# EAGLE design dmf (EAGLE 7.1.0)

## Sheet 1 of 2
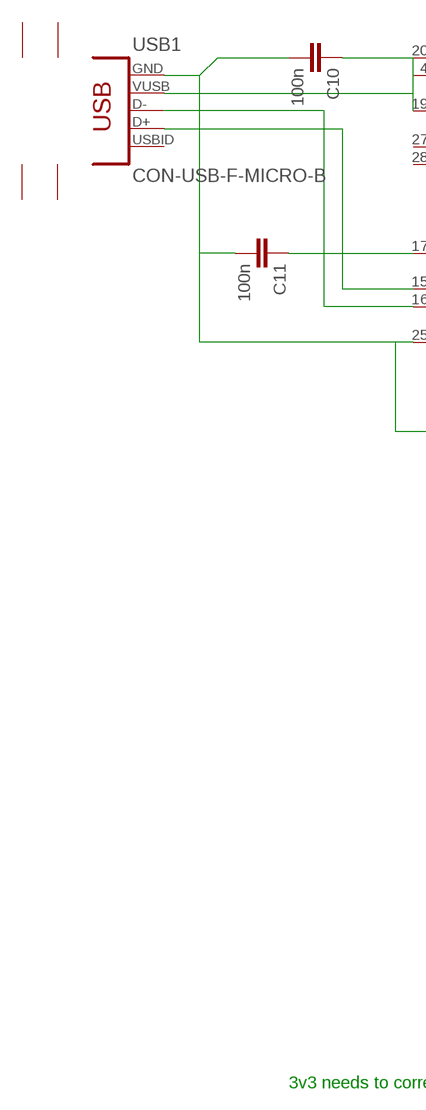
[diagram p0: schematic, sheet 1, part 1 of 2]
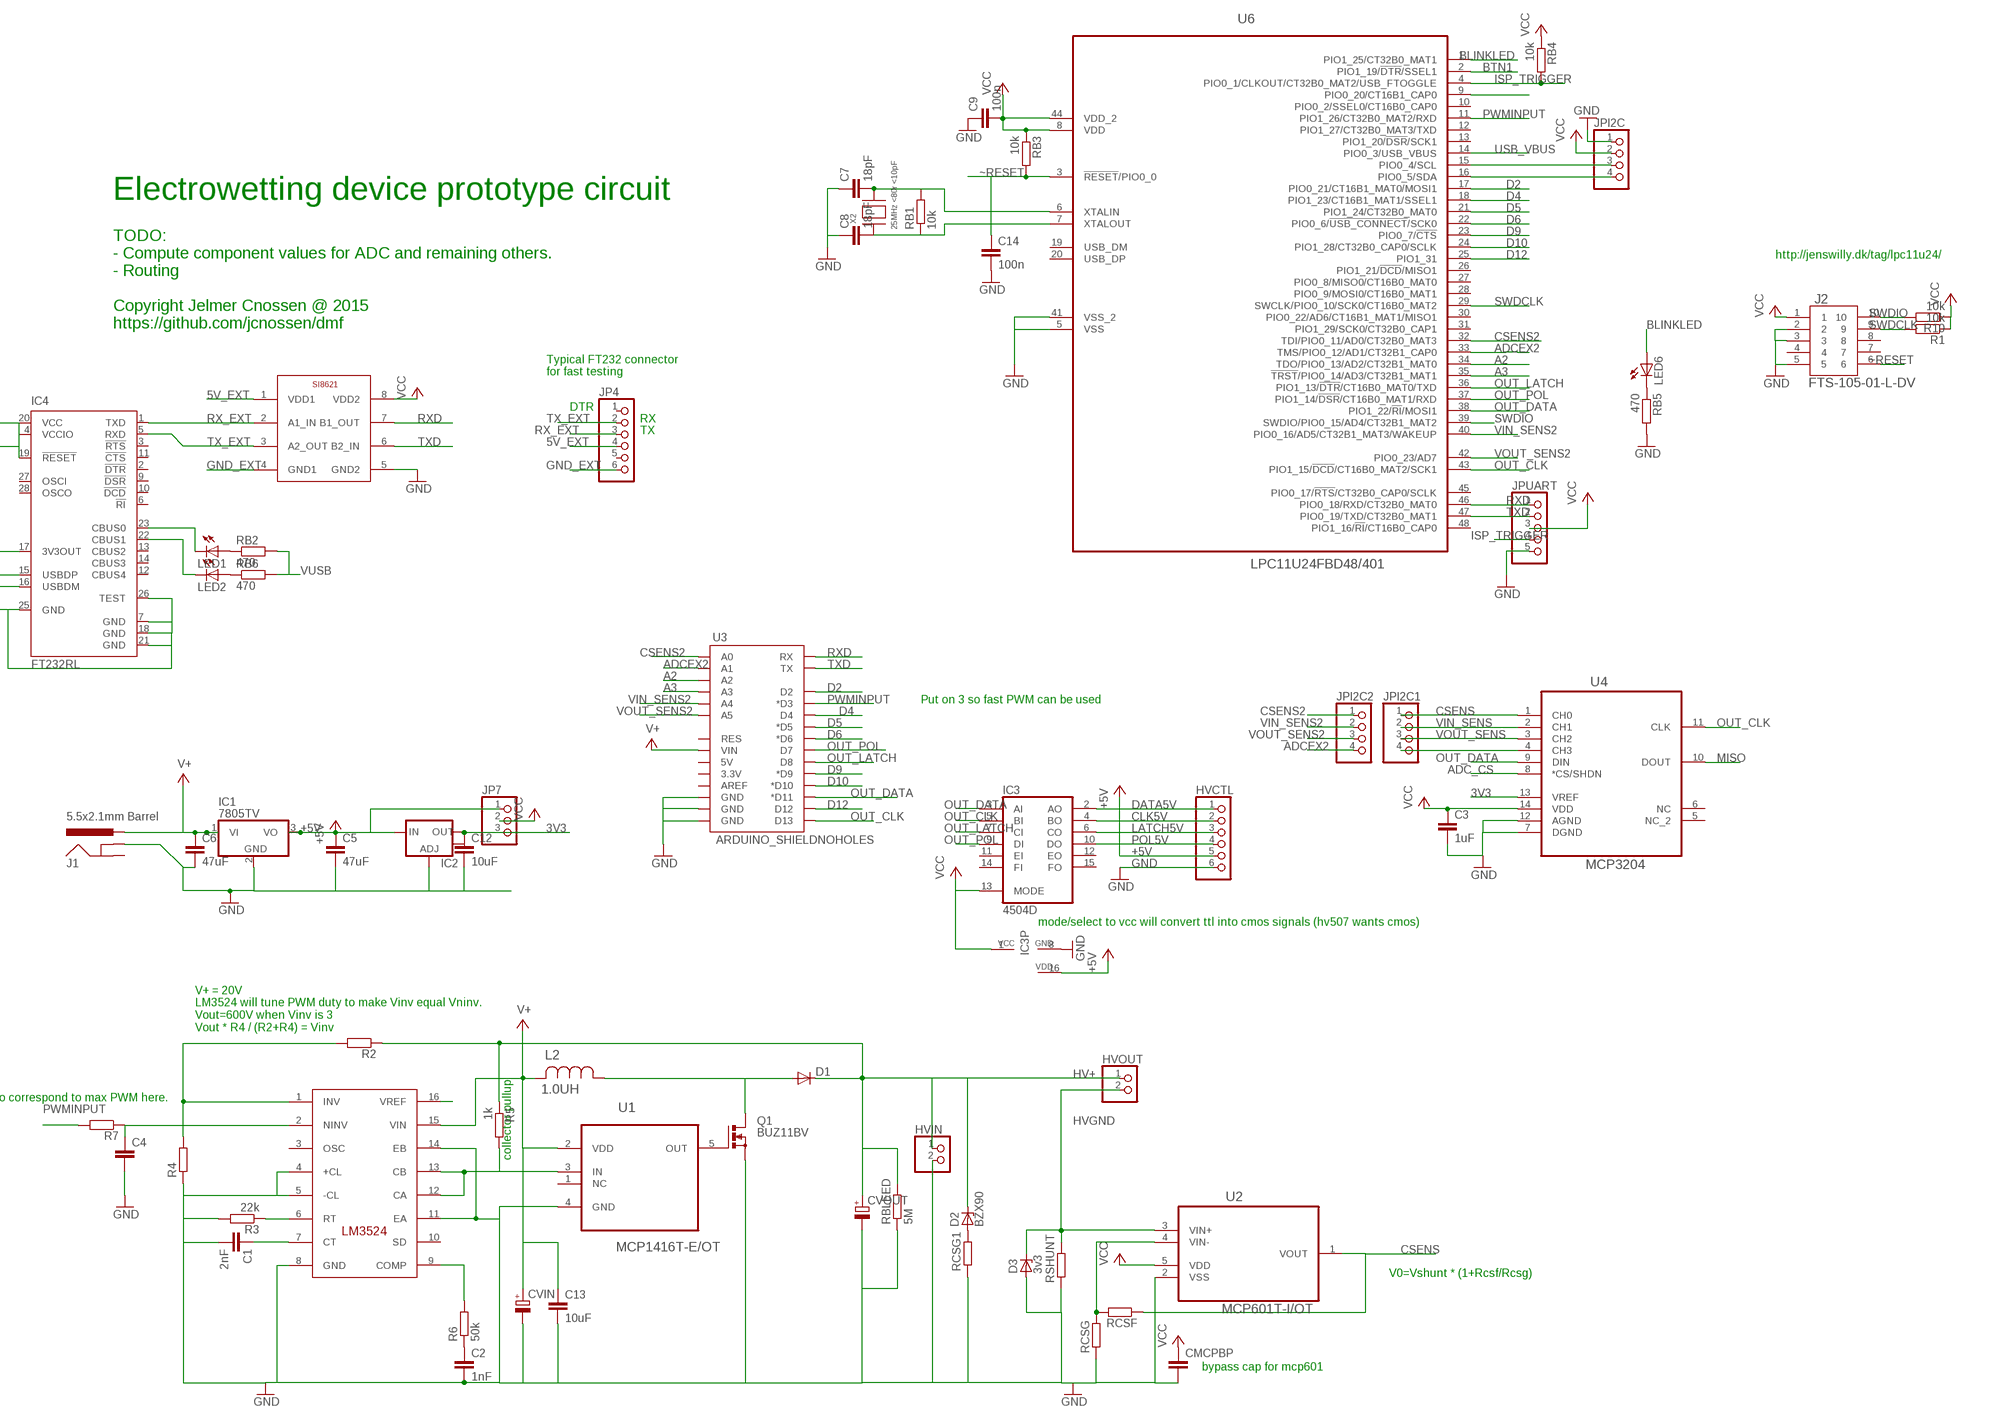
[diagram p1: schematic, sheet 1, part 2 of 2]

### Parts
C1  2nF  C-EUC0805  [C0805]
C2  1nF  C-EUC0805  [C0805]
C3  1uF  C-EUC0805  [C0805]
C4  C-EUC0805  [C0805]
C5  47uF  C-EUC1206  [C1206]
C6  47uF  C-EUC1206  [C1206]
C7  18pF  C-EUC0805  [C0805]
C8  18pF  C-EUC0805  [C0805]
C9  100n  C-EUC0805  [C0805]
C10  100n  C-EUC0805  [C0805]
C11  100n  C-EUC0805  [C0805]
C12  10uF  C-EUC1206  [C1206]
C13  10uF  C-EUC0805  [C0805]
C14  100n  C-EUC0805  [C0805]
CMCPBP  C-EUC0805  [C0805]
CVIN  CPOL-EUE7.5-18  [E7,5-18]
CVOUT  CPOL-EUE7.5-18  [E7,5-18]
D1  DIODE-SMB  [SMB]
D2  BZX90  [DO34Z7]
D3  3v3  ZENER-DIODESMB  [SMB]
HVCTL  PINHD-1X06_2.54-S  [1X06-S]
HVIN  PINHD-1X02_2.54  [1X02]
HVOUT  PINHD-1X02_2.54  [1X02]
IC1  7805TV  [TO220V]
IC2  V_REG_LM1117SOT223  [SOT223]
IC3  4504D  [SO16]
IC4  FT232RL  [SSOP28]
J1  5.5x2.1mm Barrel  POWER_JACKSMD  [POWER_JACK_SMD]
J2  FTS-105-01-L-DV  [SAMTEC_FTS-105-01-L-DV]
JP4  PINHD-1X06_2.54-S  [1X06-S]
JP7  PINHD-1X03_2.54-S  [1X03-S]
JPI2C  PINHD-1X04_2.54-S  [1X04-S]
JPI2C1  PINHD-1X04_2.54-S  [1X04-S]
JPI2C2  PINHD-1X04_2.54-S  [1X04-S]
JPUART  PINHD-1X05_2.54-S  [1X05-S]
L2  1.0UH  ELL6RH1R0M-6XH  [IND_ELL6XH]
LED1  LEDCHIP-LED0805  [CHIP-LED0805]
LED2  LEDCHIP-LED0805  [CHIP-LED0805]
LED6  LEDCHIP-LED0805  [CHIP-LED0805]
Q1  BUZ11BV  [TO220BV]
R1  10k  R-EU_R0603  [R0603]
R2  R-EU_R0603  [R0603]
R3  22k  R-EU_R0603  [R0603]
R4  R-EU_R0603  [R0603]
R5  1k  R-EU_R0603  [R0603]
R6  50k  R-EU_R0603  [R0603]
R7  R-EU_R0603  [R0603]
R10  10k  R-EU_R0603  [R0603]
RB1  10k  R-EU_R0603  [R0603]
RB2  470  R-EU_R0603  [R0603]
RB3  10k  R-EU_R0603  [R0603]
RB4  10k  R-EU_R0603  [R0603]
RB5  470  R-EU_R0402  [R0402]
RB6  470  R-EU_R0603  [R0603]
RBLEED  5M  R-EU_R1206  [R1206]
RCSF  R-EU_R0603  [R0603]
RCSG  R-EU_R0603  [R0603]
RCSG1  R-EU_R1206  [R1206]
RSHUNT  R-EU_R1206  [R1206]
U1  MCP1416T-E/OT  [SOT95P270X145-5N]
U2  MCP601T-I/OT  [SOT95P320X145-5N]
U3  ARDUINO_SHIELDNOHOLES  [DUEMILANOVE_SHIELD_NOHOLES]
U4  MCP3204  MCP3204-CI/SL  [SOIC127P600X175-14N]
U6  LPC11U24FBD48/401  [QFP50P900X900X160-48N]
U$1  LM3524  [SO16]
U$2  SI8621AB  [SO8]
USB1  CON-USB-F-MICRO-B  [CONN_USB_MICRO-B]
X2  25MHz <80r <10pF  XTALNX5032  [NX5032]

### Nets
3V3: C12.1 IC2.2(OUT) JP7.3 U4.13(VREF)
5V_EXT: JP4.4 U$2.1(VDD1)
+5V: C5.1 HVCTL.5 IC1.3(VO) IC2.3(IN) IC3.16(VDD) JP7.1
A2: U3.A2 U6.34(TDO/PIO0_13/AD2/CT32B1_MAT0)
A3: U3.A3 U6.35(!TRST!/PIO0_14/AD3/CT32B1_MAT1)
ADC_CS: U4.8(*CS/SHDN)
ADCEX: JPI2C1.4 U4.4(CH3)
ADCEX2: JPI2C2.4 U3.A1 U6.33(TMS/PIO0_12/AD1/CT32B1_CAP0)
BLINKLED: LED6.A U6.1(PIO1_25/CT32B0_MAT1)
BTN1: U6.2(PIO1_19/!DTR!/SSEL1)
CLK5V: HVCTL.2 IC3.4(BO)
COLLECTOR: R5.2 U1.3(IN) U$1.12(CA) U$1.13(CB)
CSENS: JPI2C1.1 RCSF.1 U2.1(VOUT) U4.1(CH0)
CSENS2: JPI2C2.1 U3.A0 U6.32(TDI/PIO0_11/AD0/CT32B0_MAT3)
D2: U3.D2 U6.17(PIO0_21/CT16B1_MAT0/MOSI1)
D4: U3.D4 U6.18(PIO1_23/CT16B1_MAT1/SSEL1)
D5: U3.D5(*D5) U6.21(PIO1_24/CT32B0_MAT0)
D6: U3.D6(*D6) U6.22(PIO0_6/!USB_CONNECT!/SCK0)
D9: U3.D9(*D9) U6.23(PIO0_7/!CTS)
D10: U3.D10(*D10) U6.24(PIO1_28/CT32B0_CAP0/SCLK)
D12: U3.D12 U6.25(PIO1_31)
DATA5V: HVCTL.1 IC3.2(AO)
GND: C1.2 C2.2 C3.2 C4.2 C5.2 C6.2 C7.1 C8.1 C9.1 C12.2 C13.2 C14.2 CMCPBP.2 CVIN.- CVOUT.- D3.A HVCTL.6 HVIN.2 IC1.2(GND) IC2.1(ADJ) IC3.8(GND) J1.GND(GNDBREAK) J2.2 J2.3 J2.5 JPI2C.1 JPUART.5 Q1.S R3.2 R4.1 RB5.2 RBLEED.1 RCSG1.1 RCSG.1 RSHUNT.1 U1.4(GND) U2.2(VSS) U3.GND@0(GND) U3.GND@1(GND) U3.GND@2(GND) U4.7(DGND) U4.12(AGND) U6.5(VSS) U6.41(VSS_2) U$1.4(+CL) U$1.5(-CL) U$1.8(GND) U$1.11(EA) U$1.14(EB) U$2.5(GND2)
GND_EXT: C10.2 C11.2 IC4.7(GND) IC4.18(GND) IC4.21(GND) IC4.25(GND) IC4.26(TEST) JP4.6 U$2.4(GND1) USB1.P5(GND)
HV+: CVOUT.+ D1.C D2.C HVIN.1 HVOUT.1 R2.1 R5.1 RBLEED.2
HVGND: D3.C HVOUT.2 RSHUNT.2 U2.3(VIN+)
ISP_TRIGGER: JPUART.4 RB4.2 U6.4(PIO0_1/CLKOUT/CT32B0_MAT2/USB_FTOGGLE)
LATCH5V: HVCTL.3 IC3.6(CO)
MISO: U4.10(DOUT)
N$2: C2.1 R6.1
N$3: C1.1 U$1.7(CT)
N$4: U$1.16(VREF)
N$5: R2.2 R4.2 U$1.1(INV)
N$6: R3.1 U$1.6(RT)
N$7: R6.2 U$1.9(COMP)
N$9: D1.A L2.1 Q1.D
N$10: Q1.G U1.5(OUT)
N$11: RCSF.2 RCSG.2 U2.4(VIN-)
N$12: D2.A RCSG1.2
N$14: C4.1 R7.1 U$1.2(NINV)
N$18: IC4.16(USBDM) USB1.P2(D-)
N$19: U6.9(PIO0_20/CT16B1_CAP0)
N$20: IC4.15(USBDP) USB1.P3(D+)
N$21: C11.1 IC4.17(3V3OUT)
N$23: IC4.23(CBUS0) LED1.C
N$24: IC4.22(CBUS1) LED2.C
N$25: LED1.A RB2.1
N$26: LED2.A RB6.1
N$33: C8.2 RB1.1 U6.7(XTALOUT) X2.P$1
N$37: LED6.C RB5.1
N$41: C7.2 RB1.2 U6.6(XTALIN) X2.P$2
OUT_CLK: IC3.5(BI) U3.D13 U4.11(CLK) U6.43(PIO1_15/!DCD!/CT16B0_MAT2/SCK1)
OUT_DATA: IC3.3(AI) U3.D11(*D11) U4.9(DIN) U6.38(PIO1_22/!RI!/MOSI1)
OUT_LATCH: IC3.7(CI) U3.D8 U6.36(PIO1_13/!DTR!/CT16B0_MAT0/TXD)
OUT_POL: IC3.9(DI) U3.D7 U6.37(PIO1_14/!DSR!/CT16B0_MAT1/RXD)
POL5V: HVCTL.4 IC3.10(DO)
PWMINPUT: R7.2 U3.D3(*D3) U6.11(PIO1_26/CT32B0_MAT2/RXD)
RX_EXT: IC4.1(TXD) JP4.3 U$2.2(A1_IN)
RXD: JPUART.1 U3.RX U6.46(PIO0_18/RXD/CT32B0_MAT0) U$2.7(B1_OUT)
SCL: JPI2C.3 U6.15(PIO0_4/SCL)
SDA: JPI2C.4 U6.16(PIO0_5/SDA)
SWDCLK: J2.9 R1.2 U6.29(SWCLK/PIO0_10/SCK0/CT16B0_MAT2)
SWDIO: J2.10 R10.2 U6.39(SWDIO/PIO0_15/AD4/CT32B1_MAT2)
TX_EXT: IC4.5(RXD) JP4.2 U$2.3(A2_OUT)
TXD: JPUART.2 U3.TX U6.47(PIO0_19/TXD/CT32B0_MAT1) U$2.6(B2_IN)
USB_VBUS: U6.14(PIO0_3/USB_VBUS)
V+: C6.1 C13.1 CVIN.+ IC1.1(VI) J1.VIN0(PWR) L2.2 U1.2(VDD) U3.VIN U$1.15(VIN)
VCC: C3.1 C9.2 CMCPBP.1 IC3.1(VCC) IC3.13(MODE) J2.1 JP7.2 JPI2C.2 JPUART.3 R1.1 R10.1 RB3.1 RB4.1 U2.5(VDD) U4.14(VDD) U6.8(VDD) U6.44(VDD_2) U$2.8(VDD2)
VIN_SENS: JPI2C1.2 U4.2(CH1)
VIN_SENS2: JPI2C2.2 U3.A4 U6.40(PIO0_16/AD5/CT32B1_MAT3/WAKEUP)
VOUT_SENS: JPI2C1.3 U4.3(CH2)
VOUT_SENS2: JPI2C2.3 U3.A5 U6.42(PIO0_23/AD7)
VUSB: C10.1 IC4.4(VCCIO) IC4.19(!RESET) IC4.20(VCC) RB2.2 RB6.2 USB1.P1(VUSB)
~RESET: C14.1 J2.6 RB3.2 U6.3(!RESET!/PIO0_0)
Unconnected: IC2.4(OUT) IC3.11(EI) IC3.12(EO) IC3.14(FI) IC3.15(FO) IC4.2(!DTR) IC4.3(!RTS) IC4.6(!RI) IC4.9(!DSR) IC4.10(!DCD) IC4.11(!CTS) IC4.12(CBUS4) IC4.13(CBUS2) IC4.14(CBUS3) IC4.27(OSCI) IC4.28(OSCO) J1.P$4(GND) J2.4 J2.7 J2.8 JP4.1 JP4.5 U1.1(NC) U3.3.3V U3.5V U3.AREF U3.RES U4.5(NC_2) U4.6(NC) U6.10(PIO0_2/SSEL0/CT16B0_CAP0) U6.12(PIO1_27/CT32B0_MAT3/TXD) U6.13(PIO1_20/!DSR!/SCK1) U6.19(USB_DM) U6.20(USB_DP) U6.26(PIO1_21/!DCD!/MISO1) U6.27(PIO0_8/MISO0/CT16B0_MAT0) U6.28(PIO0_9/MOSI0/CT16B0_MAT1) U6.30(PIO0_22/AD6/CT16B1_MAT1/MISO1) U6.31(PIO1_29/SCK0/CT32B0_CAP1) U6.45(PIO0_17/!RTS!/CT32B0_CAP0/SCLK) U6.48(PIO1_16/!RI!/CT16B0_CAP0) U$1.3(OSC) U$1.10(SD) USB1.BODY@1(BODY) USB1.BODY@2(BODY) USB1.BODY@3(BODY) USB1.BODY@4(BODY) USB1.P4(USBID)

### Notes on the sheet
- Electrowetting device prototype circuit
- http://jenswilly.dk/tag/lpc11u24/
- TODO: 
  - Compute component values for ADC and remaining others.
  - Routing
  
  Copyright Jelmer Cnossen @ 2015
  https://github.com/jcnossen/dmf
- Typical FT232 connector 
  for fast testing
- DTR
- RX
- TX
- Put on 3 so fast PWM can be used
- mode/select to vcc will convert ttl into cmos signals (hv507 wants cmos)
- V+ = 20V
  LM3524 will tune PWM duty to make Vinv equal Vninv. 
  Vout=600V when Vinv is 3
  Vout * R4 / (R2+R4) = Vinv
- 3v3 needs to correspond to max PWM here.
- collector pullup
- V0=Vshunt * (1+Rcsf/Rcsg)
- bypass cap for mcp601

## Sheet 2 of 2

## Library data of the parts
C1-C14 CMCPBP = rcl:C-EU: CAPACITOR, European symbol
CVIN CVOUT = rcl:CPOL-EU: POLARIZED CAPACITOR, European symbol
D1 = diode:DIODE-: DIODE
D2 = diode:BZX90: Z DIODE
D3 = diode:ZENER-DIODE: Z-Diode
HVCTL JP4 = pinhead-2:PINHD-1X06: PIN HEADER
HVIN HVOUT = pinhead-2:PINHD-1X02: PIN HEADER
IC1 = linear:78*: Positive VOLTAGE REGULATOR Source: http://cache.national.com/ds/LM/LM78L05.pdf http://www.fairchildsemi.com/ds/LM/LM7805.pdf
IC2 = SparkFun-PowerIC:V_REG_LM1117: Voltage Regulator LM1117 Standard adjustable voltage regulator but in SMD form. Spark Fun Electronics SKU : COM-00595
IC3 = 45xx:4504: TTL or CMOS to CMOS hex LEVEL SHIFTER
IC4 = ftdichip:FT232R: Source: http://www.ftdichip.com/Documents/DataSheets/DS_FT232R_v104.pdf; MPN: FT232RL; OC_FARNELL: 1146032; OC_NEWARK: 91K9918
J1 = SparkFun-Connectors:POWER_JACK: Power Jack This is the standard 5.5mm barrel jack for power. The PTH is the most common, proven, reliable, footprint. The Slot footprint only works if the mill layer is transmitted to the PCB fab house so be warned. Spark Fun Electronics SKU : PRT-00119 SMT: CONN-08106 Mating wall wart : TOL-00298 (and others); PROD_ID: CONN-08106
J2 = hvgen:FTS-105-01-L-DV; DESCRIPTION: Through Hole Post Header; MPN: FTS-105-01-L-DV; OC_FARNELL: 1667729; OC_NEWARK: 11P4653; PACKAGE: CONN HEADER 10POS DUAL .05" SMD; SUPPLIER: Samtec
JP7 = pinhead-2:PINHD-1X03: PIN HEADER
JPI2C JPI2C1 JPI2C2 = pinhead-2:PINHD-1X04: PIN HEADER
JPUART = pinhead-2:PINHD-1X05: PIN HEADER
L2 = Panasonic-ELL:ELL: Choke Coils; MPN: ELL6RH1R0M; OC_FARNELL: 1198589; OC_NEWARK: 01M7773; PACKAGE: SMD; SUPPLIER: PANASONIC
LED1 LED2 LED6 = adafruit:LED: LED
Q1 = transistor-power:BUZ11: N-CHANNEL MOS FET
R1 R10 = resistor:R-EU_: RESISTOR, European symbol
R2-R7 RB1-RB6 RBLEED RCSF RCSG RCSG1 RSHUNT = rcl:R-EU_: RESISTOR, European symbol
U1 = hvgen:MCP1416T-E/OT: High-Speed Power MOSFET Driver; MPN: MCP1416T-E/OT; OC_FARNELL: 1630421; OC_NEWARK: 02P6620; PACKAGE: SOT-5; SUPPLIER: Microchip
U2 = hvgen:MCP601T-I/OT: IC OPAMP SNGL SUPPLY R-R; MPN: MCP601T-I/OT; OC_FARNELL: 9758631; OC_NEWARK: 73K1003; PACKAGE: SOT-23-5; SUPPLIER: Microchip
U3 = SparkFun-Boards:ARDUINO_SHIELD: Arduino shield footprint
U4 = hvgen:MCP3204-CI/SL: IC ADC 12BIT 2.7V 4CH SPI; MPN: MCP3204-CI/SL; OC_FARNELL: 1196795; OC_NEWARK: 26M1276; PACKAGE: 14 - SOIC; SUPPLIER: Microchip
U6 = splitter-parts:LPC11U24FBD48/401: IC, 32-bit ARM Cortex-M0 microcontroller, 48LQFP; MPN: LPC11U24FBD48/401; OC_FARNELL: 2069972; OC_NEWARK: 73T6643; PACKAGE: 48LQFP; SUPPLIER: NXP
U$1 = hvgen:LM3524
U$2 = hvgen:SI8621AB
USB1 = dp_devices:CON-USB-F: USB Female connector
X2 = adafruit:XTAL: Low cost SMT crystals, no capacitors included http://www.ladyada.net/library/eagle

## Board
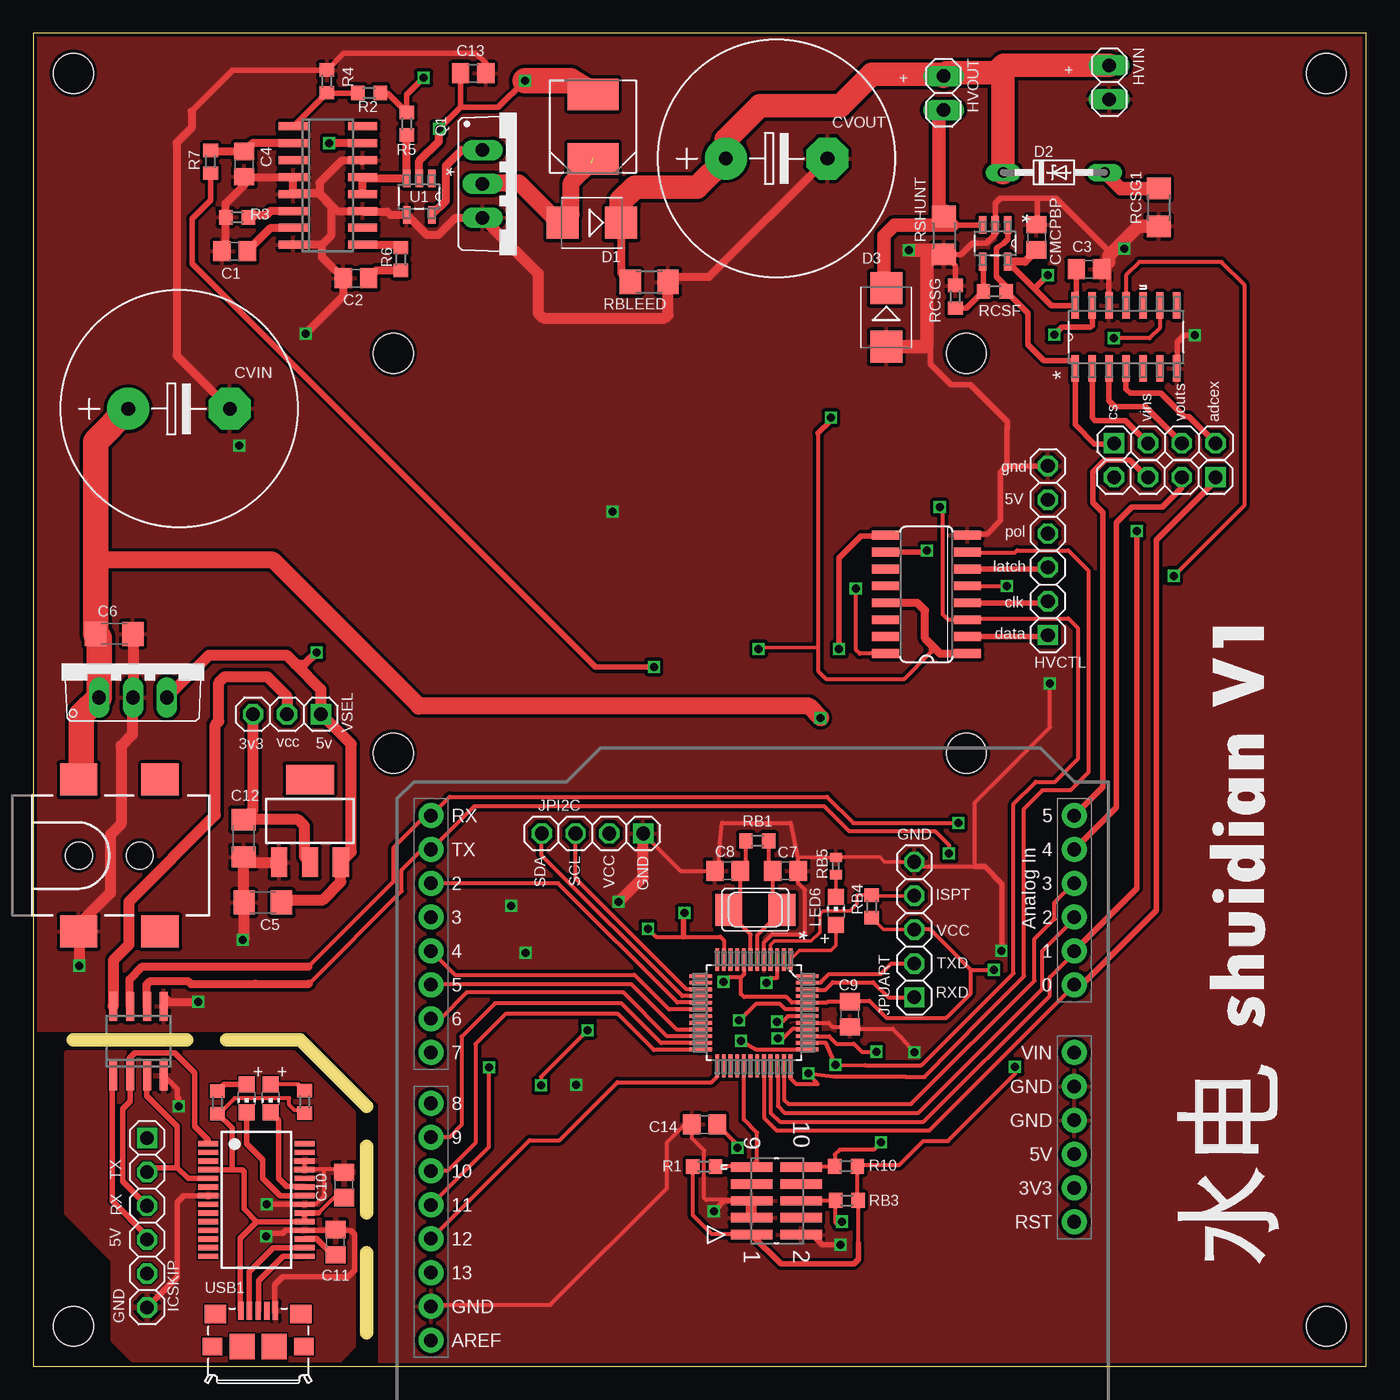
[diagram p2: board, top side]
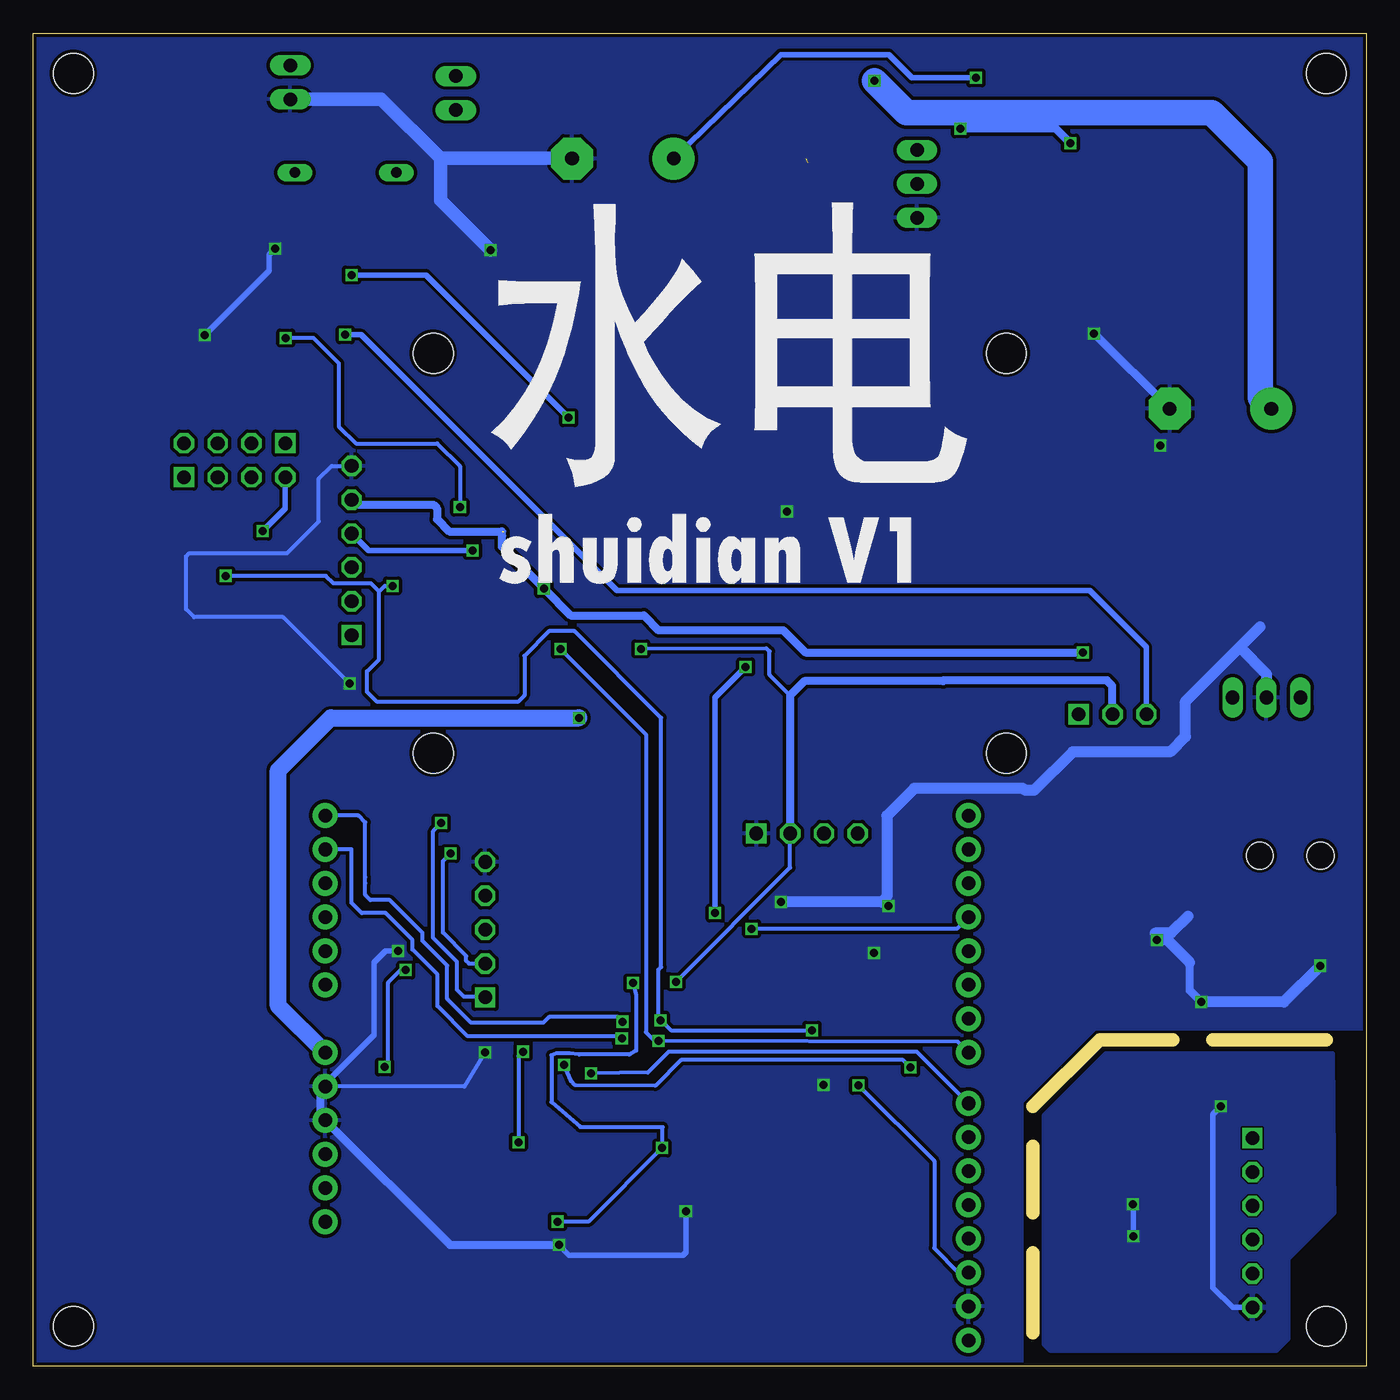
[diagram p3: board, bottom side, seen from below]

Size 100 x 100 mm. Coordinates in mm from the lower left corner, seen from the top.
Outline: 0,0 100,0 100,100 0,100 0,0
Copper layers (1*16): Top 0.035mm / dielectric 1.5mm / Bottom 0.035mm
Design rules "dirt_cheap_dirty_boards.v1": minimum track width 5mil, minimum drill 12mil, track to track 5mil, track to pad 5mil, pad to pad 5mil, via to via 5mil, smd to smd 0mil, copper to edge 10mil, drill to drill 10mil, minimum pad ring 10mil, minimum via ring 6mil, stop-mask expansion 2mil, vias tented up to drill 25mil, thermal gap 10mil
Holes 3 mm at 3,3 97,3 27,46 70,46 27,76 70,76 3,97 97,97
Milling: 5 lines

### Footprints (pad centres in the part's own frame; a part is rotated, then mirrored left to right if it is on the bottom)
C0805 = smd 1.3 x 1.5: 1 -0.95,0; 2 0.95,0
C1206 = smd 1.6 x 1.8: 1 -1.4,0; 2 1.4,0
E7,5-18 = drill 1.016 pad 3.15: + -3.81,0 | drill 1.016 pad 3.15 octagon: - 3.81,0
SMB = smd 2.4 x 2.4: A 2.2,0; C -2.2,0
DO34Z7 = drill 0.813 long: A 3.81,0; C -3.81,0
1X06-S = drill 1.016 square: 1 -6.35,0 | drill 1.016 octagon: 2 -3.81,0; 3 -1.27,0; 4 1.27,0; 5 3.81,0; 6 6.35,0
1X02 = drill 1.016 long: 1 -1.27,0; 2 1.27,0
TO220V = drill 1.016 long: 1 -2.54,-2.54; 2 0,-2.54; 3 2.54,-2.54
SOT223 = smd 1.219 x 2.235: 1 -2.311,-3.099; 2 0,-3.099; 3 2.311,-3.099 | smd 3.6 x 2.2: 4 0,3.099
SO16 = smd 0.66 x 2.032: 1 -4.445,-3.073; 2 -3.175,-3.073; 3 -1.905,-3.073; 4 -0.635,-3.073; 5 0.635,-3.073; 6 1.905,-3.073; 7 3.175,-3.073; 8 4.445,-3.073; 9 4.445,3.073; 10 3.175,3.073; 11 1.905,3.073; 12 0.635,3.073; 13 -0.635,3.073; 14 -1.905,3.073; 15 -3.175,3.073; 16 -4.445,3.073
SSOP28 = smd 0.4 x 1.5: 1 -4.225,-3.625; 2 -3.575,-3.625; 3 -2.925,-3.625; 4 -2.275,-3.625; 5 -1.625,-3.625; 6 -0.975,-3.625; 7 -0.325,-3.625; 8 0.325,-3.625; 9 0.975,-3.625; 10 1.625,-3.625; 11 2.275,-3.625; 12 2.925,-3.625; 13 3.575,-3.625; 14 4.225,-3.625; 15 4.225,3.625; 16 3.575,3.625; 17 2.925,3.625; 18 2.275,3.625; 19 1.625,3.625; 20 0.975,3.625; 21 0.325,3.625; 22 -0.325,3.625; 23 -0.975,3.625; 24 -1.625,3.625; 25 -2.275,3.625; 26 -2.925,3.625; 27 -3.575,3.625; 28 -4.225,3.625
POWER_JACK_SMD = smd 2.8 x 2.4: GND 0,-5.7; P$4 6.1,-5.7; VIN0 0,5.7; VIN1 6.1,5.7 | hole 2.032: 0,0; 4.572,0
SAMTEC_FTS-105-01-L-DV = smd 0.711 x 3.124: 1 2.54,-1.854; 2 2.54,1.854; 3 1.27,-1.854; 4 1.27,1.854; 5 0,-1.854; 6 0,1.854; 7 -1.27,-1.854; 8 -1.27,1.854; 9 -2.54,-1.854; 10 -2.54,1.854
1X03-S = drill 1.016 square: 1 -2.54,0 | drill 1.016 octagon: 2 0,0; 3 2.54,0
1X04-S = drill 1.016 square: 1 -3.81,0 | drill 1.016 octagon: 2 -1.27,0; 3 1.27,0; 4 3.81,0
1X05-S = drill 1.016 square: 1 -5.08,0 | drill 1.016 octagon: 2 -2.54,0; 3 0,0; 4 2.54,0; 5 5.08,0
IND_ELL6XH = smd 2.362 x 3.81: 1 -2.413,0; 2 2.413,0
CHIP-LED0805 = smd 1.2 x 1.2: A 0,-1.05; C 0,1.05
TO220BV = drill 1.016 long: D 0,-2.54; G -2.54,-2.54; S 2.54,-2.54
R0603 = smd 1 x 1.1: 1 -0.85,0; 2 0.85,0
R0402 = smd 0.7 x 0.9: 1 -0.65,0; 2 0.65,0
R1206 = smd 1.6 x 1.803: 1 -1.422,0; 2 1.422,0
SOT95P270X145-5N = smd 1.321 x 0.559: 1 -1.372,0.94; 2 -1.372,0; 3 -1.372,-0.94; 4 1.372,-0.94; 5 1.372,0.94
SOT95P320X145-5N = smd 1.321 x 0.559: 1 -1.372,0.94; 2 -1.372,0; 3 -1.372,-0.94; 4 1.372,-0.94; 5 1.372,0.94
DUEMILANOVE_SHIELD_NOHOLES = drill 1.016 pad 1.88: 3.3V 50.8,26.67; 5V 50.8,29.21; A0 50.8,41.91; A1 50.8,44.45; A2 50.8,46.99; A3 50.8,49.53; A4 50.8,52.07; A5 50.8,54.61; AREF 2.54,15.24; D2 2.54,49.53; D3 2.54,46.99; D4 2.54,44.45; D5 2.54,41.91; D6 2.54,39.37; D7 2.54,36.83; D8 2.54,33.02; D9 2.54,30.48; D10 2.54,27.94; D11 2.54,25.4; D12 2.54,22.86; D13 2.54,20.32; GND@0 50.8,31.75; GND@1 50.8,34.29; GND@2 2.54,17.78; RES 50.8,24.13; RX 2.54,54.61; TX 2.54,52.07; VIN 50.8,36.83
SOIC127P600X175-14N = smd 1.981 x 0.559: 1 -2.362,3.81; 2 -2.362,2.54; 3 -2.362,1.27; 4 -2.362,0; 5 -2.362,-1.27; 6 -2.362,-2.54; 7 -2.362,-3.81; 8 2.362,-3.81; 9 2.362,-2.54; 10 2.362,-1.27; 11 2.362,0; 12 2.362,1.27; 13 2.362,2.54; 14 2.362,3.81
QFP50P900X900X160-48N = smd 1.702 x 0.279: 1 -3.988,2.743; 2 -3.988,2.261; 3 -3.988,1.753; 4 -3.988,1.245; 5 -3.988,0.762; 6 -3.988,0.254; 7 -3.988,-0.254; 8 -3.988,-0.762; 9 -3.988,-1.245; 10 -3.988,-1.753; 11 -3.988,-2.261; 12 -3.988,-2.743; 25 3.988,-2.743; 26 3.988,-2.261; 27 3.988,-1.753; 28 3.988,-1.245; 29 3.988,-0.762; 30 3.988,-0.254; 31 3.988,0.254; 32 3.988,0.762; 33 3.988,1.245; 34 3.988,1.753; 35 3.988,2.261; 36 3.988,2.743 | smd 0.279 x 1.702: 13 -2.743,-3.988; 14 -2.261,-3.988; 15 -1.753,-3.988; 16 -1.245,-3.988; 17 -0.762,-3.988; 18 -0.254,-3.988; 19 0.254,-3.988; 20 0.762,-3.988; 21 1.245,-3.988; 22 1.753,-3.988; 23 2.261,-3.988; 24 2.743,-3.988; 37 2.743,3.988; 38 2.261,3.988; 39 1.753,3.988; 40 1.245,3.988; 41 0.762,3.988; 42 0.254,3.988; 43 -0.254,3.988; 44 -0.762,3.988; 45 -1.245,3.988; 46 -1.753,3.988; 47 -2.261,3.988; 48 -2.743,3.988
SO16' = smd 0.6 x 2.2: 1 -4.445,-2.6; 2 -3.175,-2.6; 3 -1.905,-2.6; 4 -0.635,-2.6; 5 0.635,-2.6; 6 1.905,-2.6; 7 3.175,-2.6; 8 4.445,-2.6; 9 4.445,2.6; 10 3.175,2.6; 11 1.905,2.6; 12 0.635,2.6; 13 -0.635,2.6; 14 -1.905,2.6; 15 -3.175,2.6; 16 -4.445,2.6
SO8 = smd 0.6 x 2.2: 1 -1.905,-2.6; 2 -0.635,-2.6; 3 0.635,-2.6; 4 1.905,-2.6; 5 1.905,2.6; 6 0.635,2.6; 7 -0.635,2.6; 8 -1.905,2.6
CONN_USB_MICRO-B = smd 1.6 x 1.4: BODY@1 -3.2,2.45; BODY@2 3.2,2.45 | smd 1.45 x 1.3: BODY@3 3.425,0; BODY@6 -3.425,0 | smd 1.9 x 1.9: BODY@4 1.2,0; BODY@5 -1.2,0 | smd 0.4 x 1.35: P1 -1.3,2.675; P2 -0.65,2.675; P3 0,2.675; P4 0.65,2.675; P5 1.3,2.675
NX5032 = smd 2 x 2.4: P$1 2,0; P$2 -2,0

### Placement (x,y rotation side)
C1  15.11,83.65 180 top
C2  24.2,81.62 180 top
C3  79.2,82.3 0 top
C4  15.82,90.19 270 top
C5  17.22,34.78 180 top
C6  6.07,54.95 0 top
C7  56.43,37.17 180 top
C8  52.09,37.17 0 top
C9  61.26,26.41 90 top
C10  23.3,13.6 90 top
C11  22.67,9.31 90 top
C12  15.78,39.61 270 top
C13  33,97 0 top
C14  50.36,18.14 180 top
CMCPBP  75.27,84.69 90 top
CVIN  10.93,71.83 0 top
CVOUT  55.77,90.61 0 top
D1  41.91,85.78 180 top
D2  76.57,89.56 0 top
D3  63.99,78.68 270 top
HVCTL  76.12,61.2 90 top
HVIN  80.72,96.32 270 top
HVOUT  68.29,95.52 270 top
IC1  7.48,52.71 0 top
IC2  20.76,40.91 0 top
IC3  67.01,57.91 90 top
IC4  16.74,12.47 270 top
J1  3.41,38.31 0 top
J2  55.75,12.41 270 top
JP4  8.54,10.76 270 top
JP7  19.03,48.91 180 top
JPI2C  41.95,39.97 180 top
JPI2C1  84.9,69.25 0 top
JPI2C2  84.9,66.7 180 top
JPUART  66.1,32.75 90 top
L2  42,93 90 top
LED1  17.8,20.1 180 top
LED2  16,20.1 180 top
LED6  60.23,34.15 0 top
Q1  36.24,88.7 270 top
R1  50.34,14.99 0 top
R2  25.19,95.52 180 top
R3  15.29,86.19 180 top
R4  22.03,96.39 270 top
R5  28.02,93.22 270 top
R6  27.58,83.07 90 top
R7  13.3,90.36 270 top
R10  60.98,15 180 top
RB1  54.32,39.41 0 top
RB2  20.36,19.83 270 top
RB3  61.04,12.44 180 top
RB4  62.89,34.5 90 top
RB5  60.2,37.52 90 top
RB6  13.82,19.8 270 top
RBLEED  46.2,81.35 180 top
RCSF  72.13,80.64 180 top
RCSG  69.18,80.23 270 top
RCSG1  84.43,86.94 90 top
RSHUNT  68.33,84.83 90 top
U1  28.95,87.75 270 top
U2  72.16,84.24 270 top
U3  27.3,-13.3 0 top
U4  81.98,77.21 90 top
U6  54.06,26.52 270 top
U$1  LM3524  [SO16']  22.11,88.58 270 top
U$2  7.89,24.4 0 top
USB1  16.87,1.47 0 top
X2  54.17,34.24 180 top

### Tracks (layer width: path | path; a pad name or v marks a point on that pad's centre or on a via)
3V3  (via drill 0.6)
  Top 0.406: v76.6,77.38 77.18,77.96 79.32,77.96 79.44,78.08 U4.13
  Top 0.813: IC2.2 20.35,38.22 20.35,40.52 19.86,41.01 C12.1 16.49,41.72 JP7.3
  Bottom 0.406: JP7.3 16.5,53.94 20.74,58.18 56.2,58.18 75.4,77.38 v76.6,77.38 76.6,77.36
5V_EXT
  Top 0.406: U$2.1 5.9,21.71 5.9,12.4 8.54,9.76 JP4.4
+5V  (via drill 0.6)  (1 unrouted)
  Top 0.305: IC3.16 62,53.46 61.72,53.74 v61.7,58.34
  Top 0.61: v21.26,53.56 20.37,52.67 19.67,52.67
  Top 0.813: C5.1 18.84,35 21.73,35 23.07,36.34 IC2.3 23.85,38.59 23.85,46.68 21.62,48.91 JP7.1 21.57,50.77 19.67,52.67 19,53.34 13.19,53.34 IC1.3
  Bottom 0.305: 64.68,62.3 64.68,62.62
  Bottom 0.61: HVCTL.5 75.75,64.64 69.98,64.64 69.72,64.38 69.72,63.54 68.8,62.62 64.84,62.62 64.84,61.48 v61.7,58.34 59.68,56.32 54.2,56.32 53.09,55.21 43.73,55.21 42.08,53.56 v21.26,53.56
A2
  Top 0.305: U6.34 55.85,22.5 55.85,19.52 56.35,19.02 66.4,19.02 75.69,28.31 75.69,31.14 78.1,33.55 U3.A2
A3
  Top 0.305: U6.35 56.33,22.52 56.33,20 56.66,19.67 65.86,19.67 75.11,28.92 75.11,32.05 76.61,33.55 76.61,34.79 78.05,36.23 U3.A3
ADCEX
  Top 0.406: U4.4 81.98,73.32 82.3,73 84.6,73 86.35,71.25 86.71,71.25 JPI2C1.4
ADCEX2  (via drill 0.6)
  Top 0.305: U6.33 55.32,19.02 56,18.34 66.79,18.34 76.25,27.8 76.25,29.17 78.1,31.02 U3.A1
  Top 0.406: v82.8,62.65 82.8,35.85 U3.A1
  Bottom 0.406: JPI2C2.4 81.09,64.36 v82.8,62.65
BLINKLED
  Top 0.254: U6.1 57.5,31.2 59.85,31.2 60.23,31.58 LED6.A
CLK5V
  Top 0.406: IC3.4 76,57.27 HVCTL.2
COLLECTOR
  Top 0.61: U$1.12 U$1.13 24.8,89.12 U1.3 R5.2
CSENS
  Top 0.406: JPI2C1.1 81.04,69.2 79.6,69.2 78.17,70.63 U4.1 78.17,75.45 75.81,75.45 74.62,76.64 74.62,79 RCSF.1 72.98,81.02 72.25,81.75 72.25,83.85 72.35,83.95 72.8,84.25 73.1,84.55 U2.1
CSENS2
  Top 0.305: U6.32 54.82,18.62 55.76,17.68 67.22,17.68 78.1,28.56 U3.A0
  Top 0.406: JPI2C2.1 88.71,66.46 84.25,62 84.25,34.2 78.66,28.61 U3.A0
D2
  Top 0.305: U6.17 50.07,27.29 48.32,27.29 39.38,36.23 U3.D2
D4
  Top 0.305: U6.18 50.06,26.76 47.7,26.76 45.1,29.36 31.63,29.36 U3.D4
D5
  Top 0.305: U3.D5 29.9,28.67 44.85,28.67 48.24,25.27 U6.21
D6
  Top 0.305: U6.22 50.06,24.75 47.55,24.75 44.27,28.03 32.51,28.03 30.55,26.07 U3.D6
D9
  Top 0.305: U6.23 50.06,24.24 47.11,24.24 44.13,27.22 34.64,27.22 32.13,24.71 32.13,18.09 31.22,17.18 U3.D9
D10
  Top 0.305: U6.24 50.03,23.73 46.55,23.73 43.86,26.42 35.42,26.42 33.17,24.17 33.17,16.74 31.07,14.64 U3.D10
D12
  Top 0.305: U6.25 51.32,21.74 50.89,21.31 43.83,21.31 39.48,16.96 37.24,16.96 U3.D12
DATA5V
  Top 0.406: IC3.2 76,54.73 HVCTL.1
GND  (via drill 0.6)
  Top 0.254: JPUART.5 63.87,37.83 63.5,38.2 60.23,38.2 RB5.2 57.55,38.17 57.38,38
  Top 0.305: U6.5 54.81,30.52 54.81,31.78 55.43,32.4 57.78,32.4 57.91,32.53 57.91,35.73 57.38,36.26 C7.1 57.38,38 56.81,40.77 51.67,40.77 51.46,38.5 51.46,37.49 C8.1 48.56,37.17 JPI2C.1 | U3.GND@2 29.95,4.59 38.78,4.59 47.53,13.34 47.53,16.78 48.89,18.14 C14.2 49.41,17.1 50.33,16.18 50.33,12.61 50.47,12.47 53.83,12.47 J2.5 | U6.41 59.67,25.76 59.97,25.46 C9.1 61.4,25.32 64.46,25.32 65.1,24.68 v66.12,23.56 | JPUART.5 66.45,37.48 70.66,37.48 70.64,37.5 70.64,42.28 76.28,47.92 v76.28,51.22
  Top 0.406: J2.2 57.7,9.77 58.54,9.77 59.22,9.09 v60.56,9.09 | v51.05,11.62 51.84,12.41 J2.5 | 11.87,94.15 14.96,97.24 R4.1 23.29,98.5 33.19,98.5 33.95,97.74 C13.2 | HVCTL.6 73.06,67.55 | 73.06,67.55 72.57,67.06 72.57,63.45 71.57,62.45 70.18,62.45 IC3.8 | RCSG.1 69.18,82.56 RSHUNT.1 69.61,83.41 70.45,84.25 71.5,84.25 72.1,84.85 | U2.2 72.1,85.55 72.1,84.85 | v72.64,31.14 72.68,31.18 72.68,36.18 71.38,37.48 70.66,37.48 | 72.1,84.85 72.18,84.93 72.18,87.26 72.56,87.64 75.34,87.64 | 75.34,87.64 76.72,87.64 80.71,83.65 | 80.71,83.65 80.71,83.32 U4.12 | U4.7 85.82,74.88 85.82,76.82 86.34,77.34 v87.16,77.34 | 80.71,83.65 80.9,83.84 v81.84,83.84 | CMCPBP.2 75.34,85.71 75.34,87.64 | 73.06,67.55 73.06,70.38 73.08,70.38 73.08,70.88 70.32,73.64 68.86,73.64 67.32,75.18 67.32,76.51 66.93,76.51
  Top 0.61: Q1.S 31.68,86.16 30.4,84.88 29.51,84.88 U1.4 26.79,86.38 26.55,86.62 24.77,86.62 U$1.11 22.8,86.67 21.48,88 | U$1.5 U$1.4 15.85,89.22 C4.2 15.82,88.62 14.43,87.23 R3.2 14.44,83.93 C1.2 | U$1.5 19.57,88 21.48,88 | U$1.14 24.66,90.44 23.13,90.44 21.48,88.79 21.48,88 | U$1.5 19.59,88.03 21.36,88.03 22.34,87.05 22.34,84.81 21.66,84.14 | 21.66,84.14 U$1.8 | 21.66,84.14 21.66,83.2 C2.2 23.25,80.29 v20.44,77.48 | U$2.5 9.78,27.02 9.78,27.75 10.2,27.33 v12.38,27.33 | RBLEED.1 48.01,81.74 50.71,81.74 CVOUT.- | 11.87,94.15 11.87,92.91 10.74,91.78 10.74,75.83 CVIN.-
  Top 0.813: IC2.1 16.18,37.81 C12.2 15.78,34.82 C5.2 15.82,32.1 v15.69,31.97 | C6.2 IC1.2 7.43,50.12 7.43,47.39 6.58,46.54 6.58,40.67 5.77,39.86 5.77,35.5 3.41,33.14 J1.GND 3.45,32.57 v3.45,30.05 | J2.3 J2.5 | v43.92,34.82 45.76,36.66 JPI2C.1 | Q1.S 37.88,81.98 37.88,79.02 38.26,78.64 47.38,78.64 47.62,78.88 RBLEED.1
  Top 1.016: v65.7,83.74 67.2,83.74 | 67.2,83.74 68,83.74 RSHUNT.1 | RCSG1.1 82.91,85.52 80.71,83.32 80.71,82.86 C3.2 | D3.A 66.9,76.48 66.93,76.51 67.04,76.62 67.04,83.58 67.2,83.74
  Bottom 0.305: v66.12,23.56 67.65,20.99 U3.GND@1 | v76.28,51.22 81.26,56.2 87.94,56.2 88.54,56.8 88.54,60.76 88.3,61 80.96,61 78.58,63.38 78.58,66.58 77.61,67.55 HVCTL.6
  Bottom 0.406: v60.56,9.09 59.8,8.33 51.27,8.33 51.05,8.55 v51.05,11.62 | 78.1,21.2 74.44,24.86 74.44,30.28 73.58,31.14 v72.64,31.14 | v87.16,77.34 82.29,82.21 82.29,83.39 v81.84,83.84
  Bottom 0.61: v12.38,27.33 13.24,28.19 13.24,30.28 | v60.56,9.09 68.74,9.09 U3.GND@0 78.46,18.81 78.46,21.56 78.1,21.2 | v20.44,77.48 20.39,77.48 CVIN.-
  Bottom 0.813: v3.45,30.05 6.17,27.33 v12.38,27.33 | 13.24,30.28 14.93,31.97 v15.69,31.97 15.69,32.37 15.82,32.5 14.64,32.5 13.36,33.78 | 9.5,53.94 7.48,51.92 IC1.2 | v43.92,34.82 36.34,34.82 35.96,35.2 35.96,41.3 33.9,43.36 25.76,43.36 25.6,43.2 24.92,43.2 22.02,46.1 14.7,46.1 13.56,47.24 13.56,49.88 9.5,53.94 | 9.5,53.94 7.95,55.49
  Bottom 1.016: HVIN.2 73.89,95.05 69.46,90.62 | 69.46,90.62 CVOUT.- | 69.46,90.62 69.46,87.5 v65.7,83.74
  other vias: 15.46,69.08 43.46,64.12 35.86,34.52 36.94,31 40.72,21.12
  pour Bottom (isolate 0.254): -0.62,100.76 102.34,100.72 102.34,-2.72 25.82,-2.72 25.82,19.84 20.32,25.34 -2.06,25.34 -2.38,25.66 -2.24,99.02
  pour Top (isolate 0.254): -0.72,100.72 102.52,100.58 102.52,-2.86 26,-2.86 26,19.7 20.5,25.2 -1.88,25.2 -2.2,25.52 -2.2,98.9 -1.72,100.06
GND_EXT  (via drill 0.6)
  Top 0.305: IC4.26 IC4.25 20.42,14.8 21.8,14.8 | 21.8,14.8 22.7,14.8 | 20.32,12.1 20.42,12.2 21.2,12.2 21.8,12.8 21.8,14.8
  Top 0.406: USB1.P5 18.1,4.21 18.1,6.1 18.7,6.7 23.6,6.7 24.1,7.2 24.1,9.9 23.84,10.16 C11.2 22.91,10.2 IC4.18 18.95,10.2 18.71,9.96 17.68,9.96 v17.47,9.75 | IC4.21 20.32,12.1 20.27,12.15 v17.52,12.15 | JP4.6 10.8,6.67 10.8,12.3 11.29,12.79 IC4.7 | U$2.4 10.8,20.8 10.8,20.2 10.9,20.1 v10.9,19.5
  Bottom 0.406: v10.9,19.5 11.5,18.9 11.5,5.9 10.01,4.41 JP4.6 | v17.52,12.15 17.47,12.1 v17.47,9.75
  pour Top: 2.5,23.5 19.5,23.5 24,19 24,1.5 23,0.5 7.5,0.5 6,2 6,8 2.5,11.5 2.5,22
  pour Bottom: 2.55,23.44 19.49,23.44 24.14,18.79 24.14,1.69 23.64,1.19 6.8,1.19 5.89,2.1 5.89,8.08 2.43,11.54
HV+  (via drill 0.6)
  Top 0.406: R2.1 26.57,95.52 R5.1 28.02,95.4 v29.28,96.66
  Top 0.61: D1.C 44.11,82.02 RBLEED.2
  Top 1.778: D1.C 44.11,87.43 45.13,88.45 49.8,88.45 CVOUT.+ 51.96,92.02 54.52,94.58 60.54,94.58 62.9,96.94 68.14,96.94 HVOUT.1 68.56,97.06 72.3,97.06 | D2.C 72.76,97.04 72.78,97.06 72.3,97.06 | HVIN.1 72.83,97.59 72.3,97.06
  Bottom 0.406: v29.28,96.66 34.07,96.66 35.82,98.41 43.91,98.41 CVOUT.+
HVGND
  Top 0.406: U2.3 68.97,85.61 RSHUNT.2 67.93,86.65
  Top 1.016: 67.93,86.65 67.93,93.89 HVOUT.2 | 68.97,85.61 64.61,85.61 63.82,84.82 63.82,81.05 D3.C
  Top 1.778: 68.27,86.31 RSHUNT.2
ISP_TRIGGER
  Top 0.254: U6.4 55.3,31.6 55.6,31.9 58.35,31.9 59,32.55 59,33.9 59.25,34.15 61.25,34.15 61.8,34.7 61.8,35.35 RB4.2 62.95,35.29 JPUART.4
  Top 0.305: JPUART.4 65.88,35.07
LATCH5V
  Top 0.406: IC3.6 76,59.81 HVCTL.3
N$2
  Top 0.61: C2.1 25.75,82.22 R6.1
N$3
  Top 0.61: C1.1 17.82,85.41 U$1.7
N$5
  Top 0.406: R2.2 22.05,95.52 R4.2 U$1.1
N$6
  Top 0.61: U$1.6 17.8,86.67 17.5,86.37 16.62,86.37 16.44,86.19 R3.1
N$7
  Top 0.61: U$1.9 27.36,84.14 R6.2
N$9  (1 unrouted)
  Top 1.27: Q1.D 33.78,88.78 36.43,88.78 39.43,85.78 D1.A 40.36,86.43 40.36,88.78 41.88,90.3
N$10
  Top 0.61: U1.5 30.95,87.44 30.95,90.06 32.13,91.24 Q1.G
N$11
  Top 0.406: U2.4 71.28,82.81 RCSF.2 70.02,79.38 RCSG.2
N$12
  Top 1.016: RCSG1.2 81.58,88.36 D2.A
N$14
  Top 0.61: U$1.2 19.5,91.77 16.47,91.77 15.84,91.14 C4.1 13.37,91.14 R7.1
N$18
  Top 0.406: USB1.P2 16.2,4.17 16.2,7.1 18,8.89 IC4.16
N$20
  Top 0.406: USB1.P3 16.9,4.14 16.9,6.4 18.75,8.24 IC4.15
N$21
  Top 0.406: IC4.17 20.42,9.6 21.2,9.6 22.34,8.46 C11.1
N$23
  Top 0.406: IC4.23 20.31,13.5 19,13.5 18.4,14.1 18.4,18.45 LED1.C
N$24
  Top 0.406: IC4.22 18.5,12.8 17.2,14.1 17.2,15.5 16,16.7 LED2.C
N$25
  Top 0.305: RB2.1 19.89,21.15 LED1.A
N$26
  Top 0.406: RB6.1 14.32,21.15 LED2.A
N$33
  Top 0.305: U6.7 53.82,32.39 51.84,34.37 51.84,34.75 52.17,34.42 X2.P$1 53.04,35.11 C8.2 53.47,37.6 RB1.1
N$37
  Top 0.254: LED6.C 60.2,35.23 RB5.1
N$41
  Top 0.305: U6.6 54.32,32.35 56.17,34.2 X2.P$2 55.48,34.94 C7.2 55.17,37.48 RB1.2
OUT_CLK  (via drill 0.6)
  Top 0.305: U6.43 56.44,26.77 56.03,27.18 54.2,27.18 53.49,26.47 v52.96,25.95 | v41.58,25.2 38.08,21.7 v38.08,21.06 | IC3.5 v73.06,58.54 | v85.56,59.3 90.88,64.62 90.88,81.1 89.14,82.84 82.98,82.84 81.98,81.84 U4.11
  Bottom 0.305: v41.58,25.2 52.16,25.2 52.91,25.95 v52.96,25.95 52.88,25.92 53.1,26.14 53.1,29.74 52.9,29.94 52.9,48.64 59.4,55.14 61.32,55.14 63.16,53.3 63.16,50.32 63.64,49.84 74.2,49.84 74.96,50.6 74.96,52.12 74.06,53.02 74.06,58.12 | v38.08,21.06 32.41,15.39 32.41,8.85 30.58,7.02 U3.D13 | v85.56,59.3 78.06,59.3 77.48,58.72 74.66,58.72 74.06,58.12 | 74.06,58.12 73.64,58.54 v73.06,58.54
OUT_DATA  (via drill 0.6)
  Top 0.305: U3.D11 34.18,16.44 v34.18,22.41 | U6.38 59.48,24.25 v60.18,22.59 62.41,22.57 66.63,22.57 73.54,29.48 73.54,42.18 75.21,43.85 76.65,43.85 78.35,45.55 78.35,55.4 77.65,56.1 70.18,56.1 IC3.3 68.64,56.01 68.22,56.42 68.22,64.22 v68,64.44 | U4.9 84.5,79.55 84.5,77.88 83.74,77.12 v81.06,77.14
  Bottom 0.305: v34.18,22.41 34.74,22.97 51.39,22.97 53.32,21.04 59.35,21.07 59.67,21.39 v60.18,22.59 | v68,64.44 68,67.52 69.7,69.22 75.8,69.22 77.08,70.5 77.08,75.24 78.98,77.14 v81.06,77.14
OUT_LATCH  (via drill 0.6)
  Top 0.305: U6.36 56.81,21.6 57.25,21.16 58.85,21.16 v58.17,21.97 60.04,21.73 65.37,21.73 65.44,21.71 66.86,21.7 71.23,26.16 74.32,29.25 74.32,41.82 75.7,43.2 77.8,43.2 79.15,44.55 79.15,59.7 77.65,61.2 73.8,61.2 73.65,61.05 70.12,61.05 IC3.7
  Bottom 0.305: U3.D8 33.71,23.59 52.34,23.59 53.89,22.04 v58.17,21.97
OUT_POL  (via drill 0.6)
  Top 0.305: v53.11,24.4 54.17,23.78 U6.37
  Top 0.406: IC3.9 63.88,62.3 62.1,62.3 60.45,60.65 v60.45,53.8
  Bottom 0.305: U3.D7 30.65,24.34 v53.11,24.4 53.4,24.4 54.05,25.05 54.05,47.4 v60.45,53.8
POL5V  (via drill 0.6)
  Top 0.406: IC3.10 66.94,61.09 v67.06,61.2
  Bottom 0.406: v67.06,61.2 74.85,61.2 HVCTL.4
PWMINPUT  (via drill 0.6)
  Top 0.305: v46.11,32.81 46.7,32.22 48.78,32.22 51.54,32.22 51.8,31.96 U6.11
  Top 0.406: R7.2 13.3,87.49 11.9,86.09 11.9,82.73 42.17,52.46 v46.56,52.46 | v48.84,34 48.78,33.94 48.78,32.22
  Bottom 0.305: U3.D3 30.72,32.81 v46.11,32.81
  Bottom 0.406: v46.56,52.46 48.84,50.18 v48.84,34
RX_EXT
  Top 0.406: IC4.1 13.12,16.98 12.1,18 12.1,22 10.6,23.5 7.6,23.5 7.2,23.1 7.2,21.86 U$2.2 7.25,19.86 6.7,19.3 6.7,13.87 JP4.3
RXD  (via drill 0.6)
  Top 0.305: 20.64,29.98 27.04,36.38 27.04,38.93 29.42,41.31 U3.RX 31.24,42.71 59.56,42.71 61.52,40.75 v69.39,40.75 | U6.46 58.07,28.25 59.43,28.25 59.98,28.8 63.01,28.8 64.14,27.67 JPUART.1
  Top 0.61: U$2.7 7.22,27.04 7.22,29.02 8.18,29.98 20.64,29.98
  Bottom 0.305: v69.39,40.75 70,40.14 70,32.12 68.22,30.34 68.22,28.24 67.7,27.72 66.15,27.72 JPUART.1
SCL
  Top 0.305: U6.15 49.01,28.27 40.68,36.6 JPI2C.3
SDA
  Top 0.305: U6.16 48.69,27.77 38.14,38.32 JPI2C.4
SWDCLK
  Top 0.305: U6.29 53.3,18.51 54.3,17.51 54.3,15.43 53.86,14.99 | J2.9 53.86,14.99 | 53.86,14.99 R1.2
SWDIO  (via drill 0.6)
  Top 0.305: J2.10 60.08,14.95 R10.2 60.13,15.88 60.5,16.25 63.05,16.25 v63.6,16.8 | U6.39 58.07,24.75 59.7,24.75 60.25,24.2 61.55,24.2 62.15,23.6 v63.25,23.6
  Bottom 0.305: v63.25,23.6 63.6,23.25 v63.6,16.8
TX_EXT
  Top 0.305: U$2.3 8.6,21.73
  Top 0.406: 8.6,21.73 8.5,21.62 8.5,20.3 10.8,18 10.8,14.9 | 10.8,14.9 11.61,14.1 IC4.5 | JP4.2 8.87,14.9 10.8,14.9
TXD  (via drill 0.6)
  Top 0.305: 20.68,28.69 27.64,35.65 27.64,37.23 29.18,38.77 U3.TX 33.09,42.02 59.32,42.02 61.2,40.14 67.65,40.14 68.7,39.09 v68.7,38.46 | U6.47 59.06,28.78 59.71,29.43 63.59,29.43 64.37,30.21 JPUART.2
  Top 0.61: U$2.6 8.5,27.02 8.5,28.63 8.77,28.9 11.6,28.9 11.82,28.68 16.64,28.68 16.65,28.69 20.68,28.69
  Bottom 0.305: v68.7,38.46 69.27,37.89 69.27,32.53 67.52,30.78 67.52,30.42 67.31,30.21 JPUART.2
V+  (via drill 0.6)
  Top 0.406: C13.1 32.05,94.46 | 32.05,94.46 v30.43,92.84 | 32.05,94.46 34.88,94.46 v36.88,96.46
  Top 0.61: U1.2 28.96,89.13 28.96,90.43 30.43,91.9 v30.43,92.84 | U$1.15 v22.2,91.76
  Top 1.27: J1.VIN0 3.61,44.21 | v59.06,48.64 58.18,49.52 28.94,49.52 17.98,60.48 4.67,60.48
  Top 1.93: 3.61,44.21 3.61,48.84 IC1.1 4.94,54.68 C6.1 4.67,60.48 4.67,69.38 CVIN.+ | v36.88,96.46 40.32,96.46 L2.2
  Bottom 0.61: v22.2,91.76 23.28,92.84 v30.43,92.84
  Bottom 1.27: U3.VIN 81.62,27.05 81.62,44.7 77.68,48.64 v59.06,48.64
  Bottom 1.93: v36.88,96.46 34.48,94.06 11.6,94.06 7.95,90.41 7.95,72.66 CVIN.+
VCC  (via drill 0.6)
  Top 0.254: RB4.1 63.79,32.75 JPUART.3
  Top 0.305: J2.1 53.83,9.93 53.81,9.91 50.9,9.91 49.48,11.32 R1.1 | 61.89,9.22 RB3.1 61.83,12.5 R10.1 61.93,15.1 64.98,15.1 66.78,16.9 68.62,16.9 73.66,21.94 v73.66,22.44 | 63.36,26.78 62.72,27.42 61.32,27.42 C9.2 59.61,27.36 59.53,27.28 U6.44 56.91,27.29 56.5,27.7 53.32,27.7 53.09,27.93 53.09,29.16 | 63.36,26.78 63.47,26.78 | 63.36,26.78 64,26.14 68.5,26.14 70.33,27.97 70.33,29.72 | JPUART.3 67.3,32.75 70.33,29.72 | U6.8 53.33,30.48 53.33,29.4 53.09,29.16 | 53.09,29.16 52.21,29.16 51.89,28.84 v51.79,28.84 | 70.33,29.72 v72.06,29.72 | 58.88,70 58.88,53.96 | 58.88,53.96 58.88,52.16 59.48,51.56 65.34,51.56 67.35,53.57 67.35,54.15 | v54.42,53.82 54.52,53.92 58.88,53.96
  Top 0.406: J2.1 56.08,7.68 61.55,7.68 61.89,8.02 61.89,9.22 | U2.5 75.26,80.7 | 75.26,80.7 76.4,79.57 U4.14 78.25,79.65 C3.1 | v76.12,81.86 75.26,81 75.26,80.7 | v59.84,71.16 59.84,70.96 58.88,70
  Top 0.61: IC3.1 70.07,53.45 68.05,53.45 67.35,54.15 66.9,54.6 66.9,56.7 66.33,57.27 IC3.13 | CMCPBP.1 74.4,82.87 U2.5
  Top 0.813: U$2.8 6.02,27.04 6.02,30.47 7.18,31.63 7.18,34.86 13.66,41.34 13.66,48.13 13.91,48.38 13.91,51.28 14.37,51.74 17.55,51.74 19.03,50.26 JP7.2
  Bottom 0.305: v51.79,28.84 43.22,37.41 JPI2C.2 | v73.66,22.44 73.38,22.72 73.38,28.78 72.44,29.72 v72.06,29.72 | 43.22,50.33 44.76,51.87 44.76,53.62 45,53.86 v54.42,53.82
  Bottom 0.406: v76.12,81.86 70.54,81.86 v59.84,71.16
  Bottom 0.61: JP7.2 19.05,48.93 19.05,51.05 19.45,51.45 31.7,51.45 31.75,51.4 42.15,51.4 43.22,50.33 JPI2C.2
VIN_SENS
  Top 0.406: U4.2 79.44,71.16 79.65,70.95 81.93,70.95 JPI2C1.2
VIN_SENS2  (via drill 0.6)
  Top 0.305: U6.40 58.03,25.3 56.95,25.3 56.25,24.6 v55.85,24.6
  Top 0.406: JPI2C2.2 86.17,65.92 84.7,64.45 82.4,64.45 81.25,63.3 81.25,41.92 U3.A4
  Bottom 0.305: v55.85,24.6 56,24.75 67.4,24.75 69.68,27.03 69.68,29.38 71.56,31.26 71.56,31.98 73.58,34 75.36,34 76.12,34.76 76.12,38.77 U3.A4
VOUT_SENS
  Top 0.406: U4.3 80.71,72.44 81.15,72 83.42,72 JPI2C1.3
VOUT_SENS2  (via drill 0.6)
  Top 0.305: U6.42 58.04,26.25 56.6,26.25 56.2,25.85 v55.8,25.85
  Top 0.406: JPI2C2.3 83.55,66.7 82.25,68 80.4,68 79.5,67.1 79.5,64.8 80.25,64.05 80.25,43.46 U3.A5
  Bottom 0.305: v55.8,25.85 56.15,26.2 61.3,26.2 61.74,25.76 67.14,25.76 68.94,27.56 68.94,30.06 70.8,31.92 70.8,32.52 73.26,34.98 74.72,34.98 75.1,35.36 75.1,36.22 75.1,36.7 75.1,40.8 75.61,41.31 U3.A5
VUSB
  Top 0.305: RB2.2 20.14,19.2 19.6,19.2 19.2,19.6 19.2,20.1 15.1,20.1 13.95,18.95 RB6.2 | 21.4,11.5 22.5,12.6 C10.1
  Top 0.406: USB1.P1 15.5,4.21 15.5,9.6 16.75,10.85 | 16.75,10.85 IC4.19 IC4.20 21.4,11.5 | 16.75,10.85 15.8,11.79 15.8,14.6 15.65,14.74 14.9,14.74 | 14.9,14.74 IC4.4 | RB6.2 14.9,17.87 14.9,14.74
~RESET  (via drill 0.6)
  Top 0.305: U6.3 55.83,30.49 55.8,30.46 55.8,29.15 55.27,29.15 v55.02,28.75 | J2.6 57.64,12.44 RB3.2 60.19,10.75 v60.67,10.85 | C14.1 52.84,16.61 v52.84,16.37
  Bottom 0.305: v55.02,28.75 54.78,27.81 54.78,23.69 55.28,23.39 59.05,23.39 59.77,23.48 60.74,23.48 61.12,23.32 61.12,19.82 58.96,17.94 52.79,17.94 52.84,17.89 v52.84,16.37 58.36,10.85 v60.67,10.85

### Text on the board
tPlace: + | + | cs | vins | vouts | adcex | gnd | 5V | pol | latch | clk | data | VSEL | 3v3 | vcc | 5v | GND | SDA | SCL | VCC | GND | ISPT | VCC | TXD | RXD | TX | RX | 5V | ICSKIP | GND